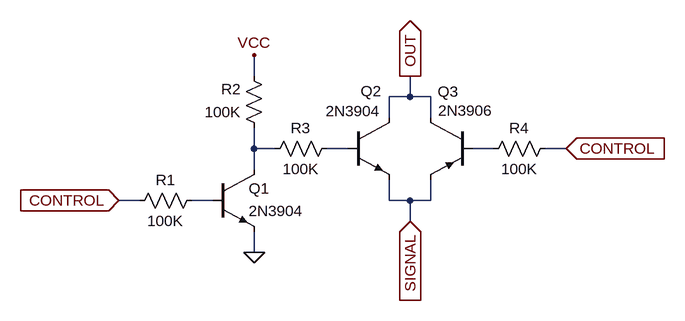
[diagram p0: schematic switch_off_3.3v.asc]
switch_off_3.3v.asc, the LTspice schematic file:
Version 4
SHEET 1 2264 680
WIRE 416 160 416 128
WIRE 656 192 656 160
WIRE 656 192 624 192
WIRE 688 192 656 192
WIRE 624 224 624 192
WIRE 688 224 688 192
WIRE 416 272 416 240
WIRE 448 272 416 272
WIRE 560 272 528 272
WIRE 784 272 752 272
WIRE 896 272 864 272
WIRE 416 304 416 272
WIRE 240 352 208 352
WIRE 352 352 320 352
WIRE 624 352 624 320
WIRE 656 352 624 352
WIRE 688 352 688 320
WIRE 688 352 656 352
WIRE 656 384 656 352
WIRE 416 432 416 400
FLAG 416 128 VCC
FLAG 416 432 0
FLAG 656 384 SIGNAL
IOPIN 656 384 In
FLAG 896 272 CONTROL
IOPIN 896 272 In
FLAG 208 352 CONTROL
IOPIN 208 352 In
FLAG 656 160 OUT
IOPIN 656 160 Out
SYMBOL res 432 256 R180
WINDOW 0 36 76 Left 2
WINDOW 3 36 40 Left 2
SYMATTR InstName R2
SYMATTR Value 100K
SYMBOL npn 352 304 R0
WINDOW 0 56 29 Left 2
WINDOW 3 56 64 Left 2
SYMATTR InstName Q1
SYMATTR Value 2N3904
SYMBOL res 336 336 R90
WINDOW 0 0 56 VBottom 2
WINDOW 3 32 56 VTop 2
SYMATTR InstName R1
SYMATTR Value 100K
SYMBOL npn 560 224 R0
WINDOW 0 20 -41 Left 2
WINDOW 3 -34 -10 Left 2
SYMATTR InstName Q2
SYMATTR Value 2N3904
SYMBOL pnp 752 224 M0
WINDOW 0 21 -40 Left 2
WINDOW 3 -32 -11 Left 2
SYMATTR InstName Q3
SYMATTR Value 2N3906
SYMBOL res 768 288 R270
WINDOW 0 32 56 VTop 2
WINDOW 3 0 56 VBottom 2
SYMATTR InstName R4
SYMATTR Value 100K
SYMBOL res 544 256 R90
WINDOW 0 0 56 VBottom 2
WINDOW 3 32 56 VTop 2
SYMATTR InstName R3
SYMATTR Value 100K

The netlist it stands for:
* switch_off_3.3v.asc
R2 N001 VCC 100K
Q1 N001 N004 0 0 2N3904
R1 N004 CONTROL 100K
Q2 OUT N002 SIGNAL 0 2N3904
Q3 OUT N003 SIGNAL 0 2N3906
R4 N003 CONTROL 100K
R3 N002 N001 100K
.model NPN NPN
.model PNP PNP
.lib standard.bjt
.backanno
.end